# EAGLE design UNO lowcost V11 (EAGLE 6.2)
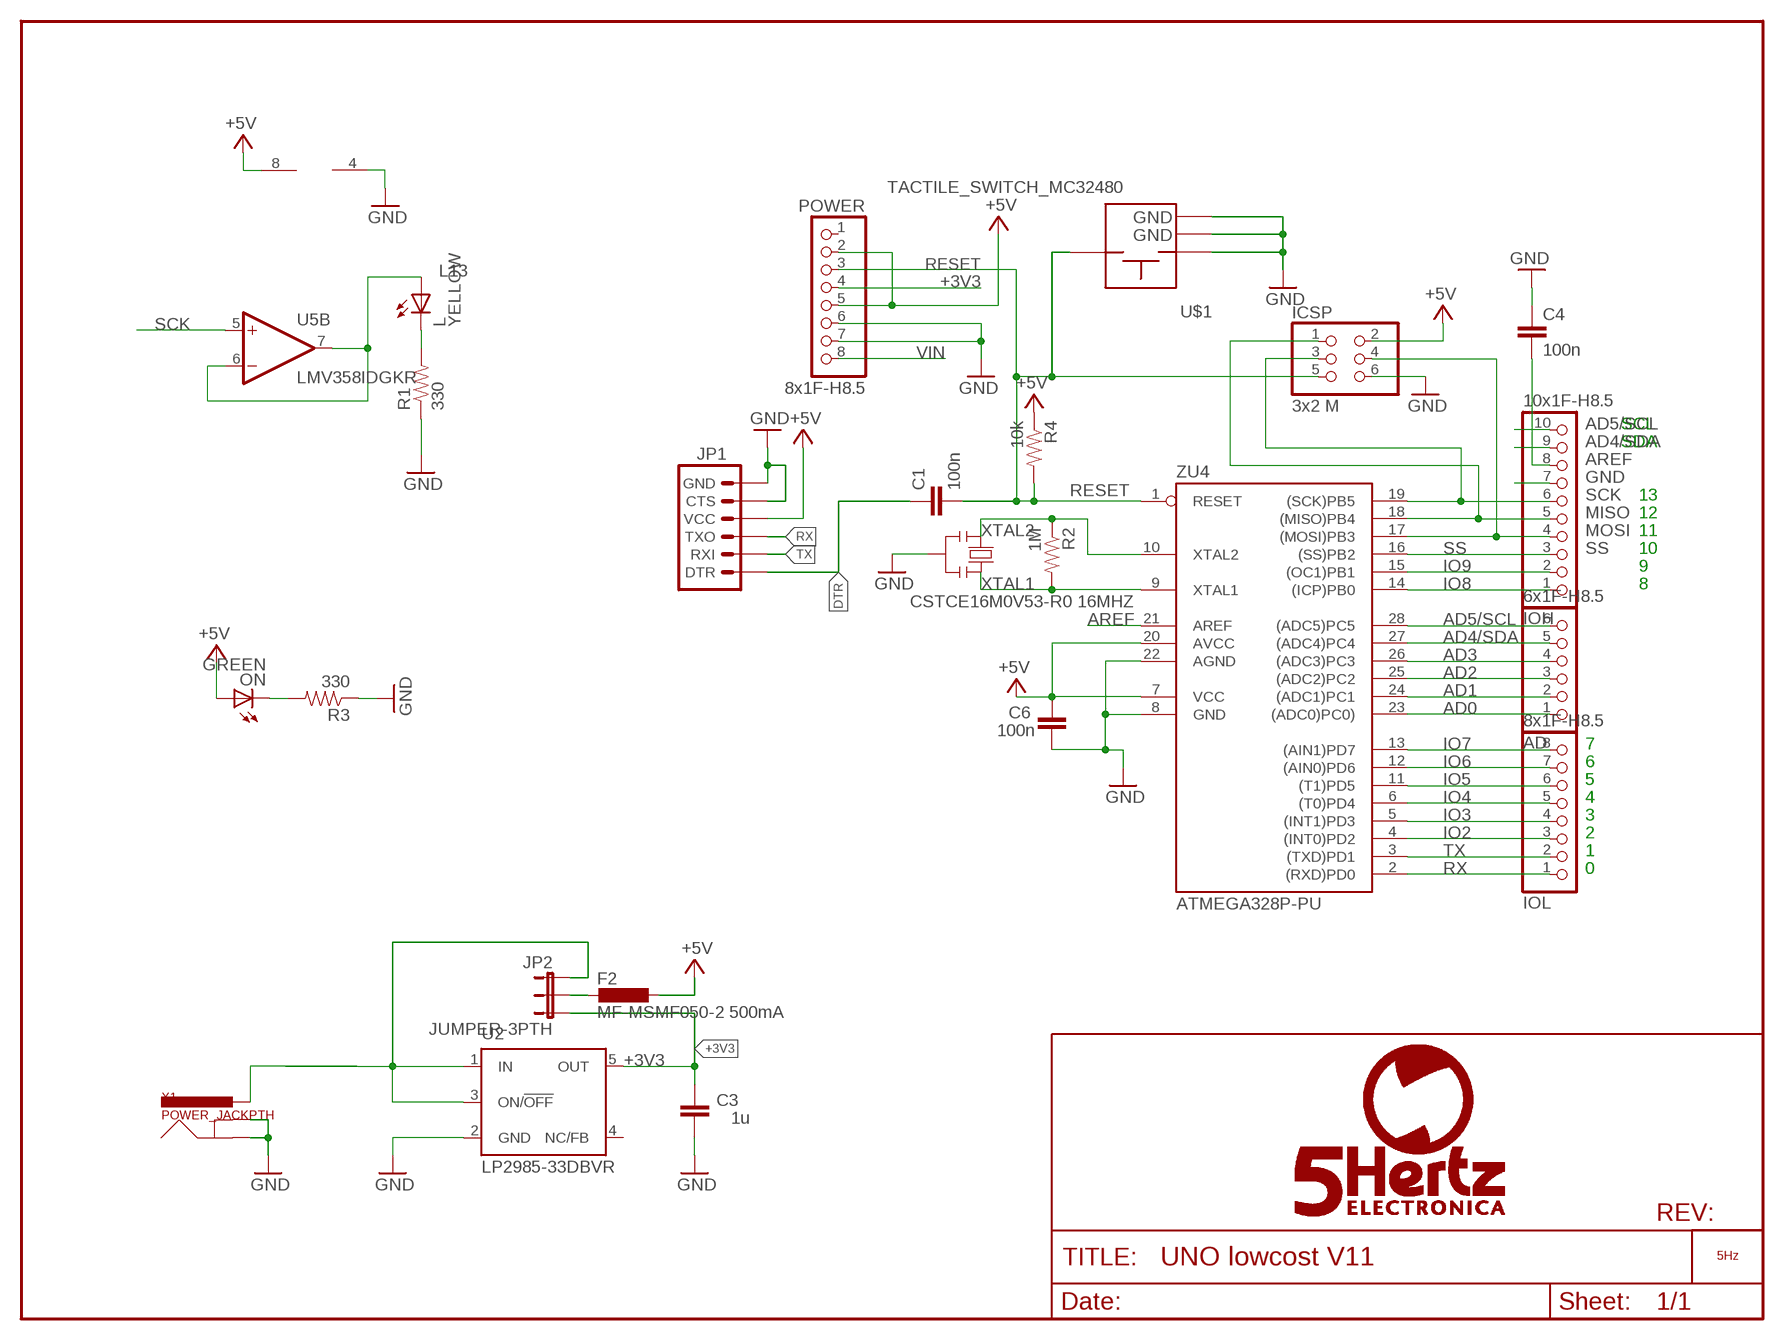
[diagram p0: schematic, sheet 1]

## Parts
AD  6x1F-H8.5  PINHD-1X6  [1X06]
C1  100n  C-EU0603-RND  [C0603-ROUND]
C3  1u  C-EU0603-RND  [C0603-ROUND]
C4  100n  C-EU0603-RND  [C0603-ROUND]
C6  100n  C-EU0603-RND  [C0603-ROUND]
F2  MF-MSMF050-2 500mA  L-EUL1812  [L1812]
ICSP  3x2 M  PINHD-2X3  [2X03]
IOH  10x1F-H8.5  PINHD-1X10_ARD  [1X10]
IOL  8x1F-H8.5  PINHD-1X8  [1X08]
JP1  ARDUINO_SERIAL_PROGRAMPTH  [1X06]
JP2  JUMPER-3PTH  [1X03]
L  YELLOW  LEDCHIP-LED0603  [CHIP-LED0603]
LOGO1  LOGO_5HZ_H_20MM  [5HZ_LOGO_H_20MM]
ON  GREEN  LEDCHIP-LED0603  [CHIP-LED0603]
POWER  8x1F-H8.5  PINHD-1X8  [1X08]
R1  330  RESISTOR0603-RES  [0603-RES]
R2  1M  RESISTOR0603-RES  [0603-RES]
R3  330  RESISTOR0603-RES  [0603-RES]
R4  10k  RESISTOR0603-RES  [0603-RES]
U2  LP2985-33DBVR  LP2985-XXDBVR33  [SOT23-DBV]
U5  LMV358IDGKR  LMV358MMX  [MSOP08]
U$1  TACTILE_SWITCH_MC32480  [MC32840]
X1  POWER_JACKPTH  [POWER_JACK_PTH]
Y2  CSTCE16M0V53-R0 16MHZ  RESONATORMU  [RESONATOR]
ZU4  ATMEGA328P-PU  [DIL28-3]

## Nets
5V/3V3 [usbvcc]: F2.2 JP2.2
+3V3: C3.2 JP2.3 POWER.4 U2.5(OUT)
+5V [usbvcc]: C6.2 F2.1 ICSP.2 JP1.4(VCC) ON.A POWER.2 POWER.5 R4.1 U5.8(P:V+) ZU4.7(VCC) ZU4.20(AVCC)
AD0: AD.1 ZU4.23((ADC0)PC0))
AD1: AD.2 ZU4.24((ADC1)PC1)
AD2: AD.3 ZU4.25((ADC2)PC2)
AD3: AD.4 ZU4.26((ADC3)PC3)
AD4/SDA: AD.5 IOH.9 ZU4.27((ADC4)PC4)
AD5/SCL: AD.6 IOH.10 ZU4.28((ADC5)PC5)
AREF [aref]: C4.2 IOH.8 ZU4.21(AREF)
DTR: C1.1 JP1.1(DTR)
GND [gnd]: C3.1 C4.1 C6.1 ICSP.6 IOH.7 JP1.5(CTS) JP1.6(GND) POWER.6 POWER.7 R1.1 R3.1 U2.2(GND) U5.4(P:V-) U$1.A@1(A) U$1.GND@1(GND) U$1.GND@2(GND) X1.GND X1.GNDBREAK Y2.2 ZU4.8(GND) ZU4.22(AGND)
IO2: IOL.3 ZU4.4((INT0)PD2)
IO3: IOL.4 ZU4.5((INT1)PD3)
IO4: IOL.5 ZU4.6((T0)PD4)
IO5: IOL.6 ZU4.11((T1)PD5)
IO6: IOL.7 ZU4.12((AIN0)PD6)
IO7: IOL.8 ZU4.13((AIN1)PD7)
IO8: IOH.1 ZU4.14((ICP)PB0)
IO9: IOH.2 ZU4.15((OC1)PB1)
L13: L.A U5.6(B:-IN) U5.7(B:OUT)
MISO: ICSP.1 IOH.5 ZU4.18((MISO)PB4)
MOSI: ICSP.4 IOH.4 ZU4.17((MOSI)PB3)
N$1: L.C R1.2
N$2: ON.C R3.2
RESET: C1.2 ICSP.5 POWER.3 R4.2 U$1.B ZU4.1(RESET)
RX: IOL.1 JP1.3(TXO) ZU4.2((RXD)PD0)
SCK: ICSP.3 IOH.6 U5.5(B:+IN) ZU4.19((SCK)PB5)
SS: IOH.3 ZU4.16((SS)PB2)
TX: IOL.2 JP1.2(RXI) ZU4.3((TXD)PD1)
VIN [power]: JP2.1 POWER.8 U2.1(IN) U2.3(ON/!OFF) X1.PWR
XTAL1: R2.2 Y2.3 ZU4.9(XTAL1)
XTAL2: R2.1 Y2.1 ZU4.10(XTAL2)
Unconnected: POWER.1 U2.4(NC/FB) U5.1(A:OUT) U5.2(A:-IN) U5.3(A:+IN)

## Notes on the sheet
- SCL
- SDA
- 13
- 12
- 11
- 10
- 9
- 8
- 7
- 6
- 5
- 4
- 3
- 2
- 1
- 0

## Library data of the parts
AD = SmartPrj:PINHD-1X6: PIN HEADER
C1 C3 C4 C6 = SmartPrj:C-EU: CAPACITOR, European symbol
F2 = rcl:L-EU: INDUCTOR, European symbol
ICSP = SmartPrj:PINHD-2X3: PIN HEADER
IOH = SmartPrj:PINHD-1X10_ARD: PIN HEADER
IOL POWER = SmartPrj:PINHD-1X8: PIN HEADER
JP1 = SparkFun_old:ARDUINO_SERIAL_PROGRAM
JP2 = SparkFun:JUMPER-3
L ON = adafruit:LED: LED OSRAM: - CHIPLED LG R971, LG N971, LY N971, LG Q971, LY Q971, LO R971, LY R971 LH N974, LH R974 LS Q976, LO Q976, LY Q976 LO Q996 - Hyper CHIPLED LW Q18S LB Q993, LB Q99A, LB R99A - SideLED LS A670, LO A670, LY A670, LG A670, LP A670 LB A673, LV A673, LT A673, LW A673 LH A674 LY A675 LS A676, LA A676, LO A676, LY A676, LW A676 LS A679, LY A679, LG A679 - Hyper Micro SIDELED® LS Y876, LA Y876, LO Y876, LY Y876 LT Y87S - SmartLED LW L88C, LW L88S LB L89C, LB L89S, LG L890 LS L89K, LO L89K, LY L89K LS L896, LA L896, LO L896, LY L896 - TOPLED LS T670, LO T670, LY T670, LG T670, LP T670 LSG T670, LSP T670, LSY T670, LOP T670, LYG T670 LG T671, LOG T671, LSG T671 LB T673, LV T673, LT T673, LW T673 LH T674 LS T676, LA T676, LO T676, LY T676, LB T676, LH T676, LSB T676, LW T676 LB T67C, LV T67C, LT T67C, LS T67K, LO T67K, LY T67K, LW E67C LS E67B, LA E67B, LO E67B, LY E67B, LB E67C, LV E67C, LT E67C LW T67C LS T679, LY T679, LG T679 LS T770, LO T770, LY T770, LG T770, LP T770 LB T773, LV T773, LT T773, LW T773 LH T774 LS E675, LA E675, LY E675, LS T675 LS T776, LA T776, LO T776, LY T776, LB T776 LHGB T686 LT T68C, LB T68C - Hyper Mini TOPLED® LB M676 - Mini TOPLED Santana® LG M470 LS M47K, LO M47K, LY M47K Source: http://www.osram.convergy.de/
LOGO1 = 5hz-electronica:LOGO_5HZ: Logotipo 5Hz "según Pedro"
R1-R4 = 5hz-electronica:RESISTOR: Resistor Basic schematic elements and footprints for 0603, 1206, and PTH 1/10th watt (small) resistors.
U2 = SmartPrj:LP2985-XXDBVR: ULTRALOW-POWER 50-mA LOW-DROPOUT LINEAR REGULATORS 50-mA Low-Dropout Regulator Source: http://focus.ti.com/lit/ds/symlink/tps77001.pdf
U5 = linear:LMV358?*: Dual General Purpose, Low Voltage, Rail-to-Rail Output Operational Amplifiers Source: http://www.national.com/mpf/LM/LMV321.html http://www.national.com/dt/lmv_qual.pdf
U$1 = PEDRO:TACTILE_SWITCH_MC32480
X1 = SparkFun:POWER_JACK: Power Jack This is the standard 5.5mm barrel jack for power. The PTH is the most common, proven, reliable, footprint. All others are experimental. The Slot footprint only works if the mill layer is transmitted to the PCB fab house so be warned. Spark Fun Electronics SKU : PRT-00119. Mating wall wart : TOL-00298 (and others)
Y2 = SmartPrj:RESONATOR
ZU4 = SmartPrj:ATMEGA328P-: MICROCONTROLLER 4 Kbytes FLASH 128 bytes SRAM 256 bytes EEPROM UART 6-channel 10 bit ADC

## Net classes
0 default: width 0.254 mm, clearance 0.254 mm
1 power: width 0.61 mm, drill 0.61 mm, clearance 0.254 mm
2 gnd: width 0.305 mm, drill 0.559 mm, clearance 0.254 mm
3 usbvcc: width 0.508 mm, drill 0.61 mm, clearance 0.254 mm
4 aref: width 0.406 mm, drill 0.61 mm, clearance 0.254 mm

## Board
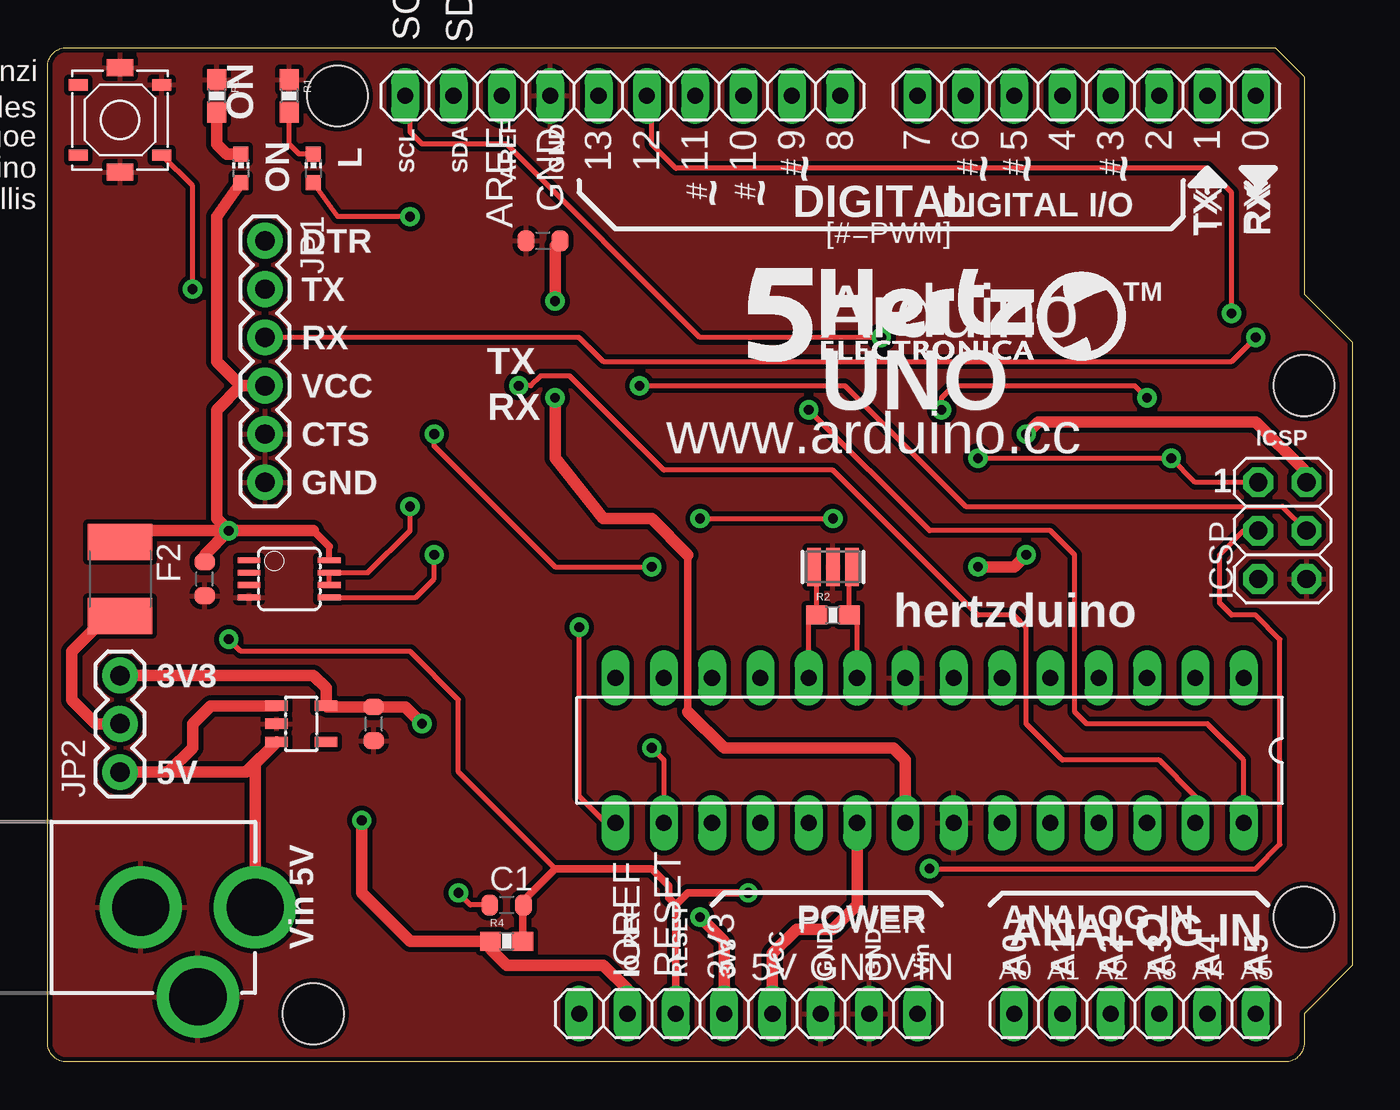
[diagram p1: board, top side]
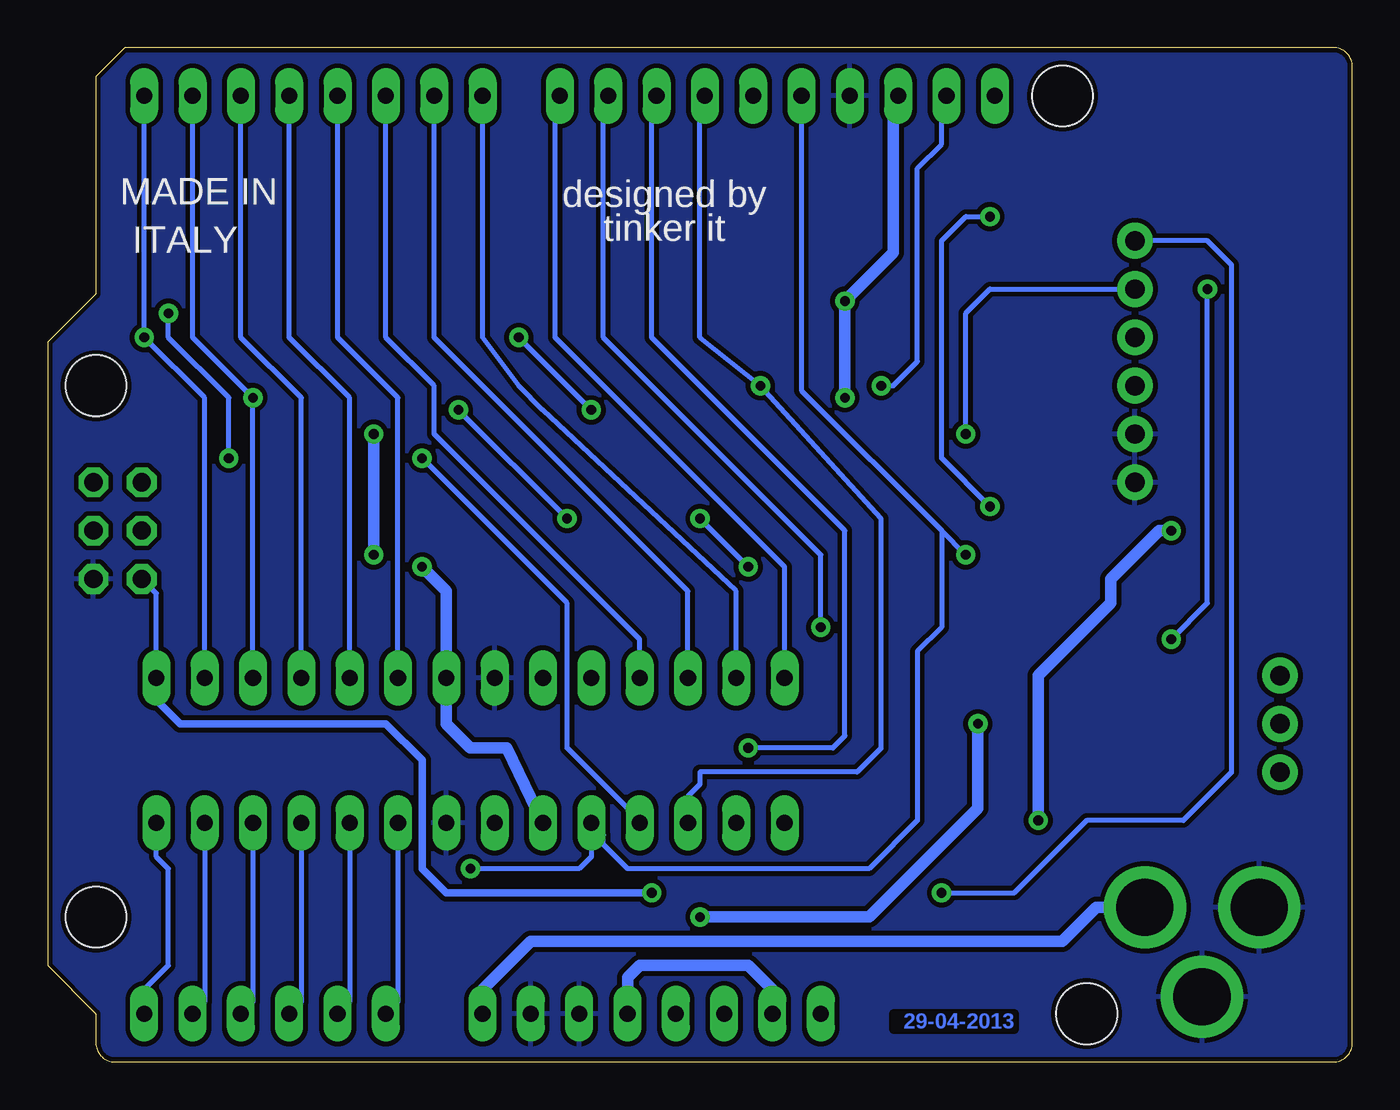
[diagram p2: board, bottom side, seen from below]

Size 68.58 x 53.34 mm. Coordinates in mm from the lower left corner, seen from the top.
Outline: 64.52,53.34 66.04,51.82 66.04,40.39 68.58,37.85 68.58,5.08 66.04,2.54 66.04,1 arc-90 65.04,0 1,0 arc-90 0,1 0,52.34 arc-90 1,53.34 64.52,53.34
Copper layers (1*16): Top 0.035mm / dielectric 1.5mm / Bottom 0.035mm
Design rules: minimum track width 8mil, minimum drill 20mil, track to track 8mil, track to pad 8mil, pad to pad 8mil, via to via 8mil, smd to smd 8mil, copper to edge 10mil, drill to drill 8mil, minimum pad ring 12mil, minimum via ring 10mil, stop-mask expansion 4mil, vias tented up to drill 25mil, thermal gap 10mil
Holes 3.2 mm at 66.04,35.56 66.04,7.62 15.24,50.8 13.97,2.54
vRestrict: area 22.9,44.1 to 24.6,49.1; area 25.4,45.5 to 27.1,49.1; area 28.4,45.3 to 29.6,48.8; area 31,45.3 to 32.1,48.8; area 33.5,45.3 to 34.7,48.8; area 36.1,45.3 to 37.2,48.8; area 38.7,47.2 to 39.9,48.8; area 40.3,45.1 to 47.6,46.9; area 60.3,44.2 to 61.7,46.7; area 62.9,44.2 to 64.3,46.7; area 61.3,35.8 to 64.8,37.2; area 0.6,21.8 to 2,30.1; 14 more areas

### Footprints (pad centres in the part's own frame; a part is rotated, then mirrored left to right if it is on the bottom)
1X06 = drill 0.85 pad 1.422 long: 1 -6.35,0; 2 -3.81,0; 3 -1.27,0; 4 1.27,0; 5 3.81,0; 6 6.35,0
C0603-ROUND = smd 0.898 x 1.1: 1 -0.889,0; 2 0.889,0
L1812 = smd 1.9 x 3.4: 1 -1.95,0; 2 1.95,0
2X03 = drill 0.95 pad 1.55 octagon: 1 -2.54,-1.27; 2 -2.54,1.27; 3 0,-1.27; 4 0,1.27; 5 2.54,-1.27; 6 2.54,1.27
1X10@1 = drill 0.85 pad 1.422 long: 1 -11.43,0; 2 -8.89,0; 3 -6.35,0; 4 -3.81,0; 5 -1.27,0; 6 1.27,0; 7 3.81,0; 8 6.35,0; 9 8.89,0; 10 11.43,0
1X08 = drill 0.85 pad 1.422 long: 1 -8.89,0; 2 -6.35,0; 3 -3.81,0; 4 -1.27,0; 5 1.27,0; 6 3.81,0; 7 6.35,0; 8 8.89,0
1X06' = drill 1.016 pad 1.88: 1 0,0; 2 2.54,0; 3 5.08,0; 4 7.62,0; 5 10.16,0; 6 12.7,0
1X03 = drill 1.016 pad 1.88: 1 0,0; 2 2.54,0; 3 5.08,0
CHIP-LED0603 = smd 0.8 x 0.8: A 0,-0.75; C 0,0.75
0603-RES = smd 1.1 x 1: 1 -0.85,0; 2 0.85,0
SOT23-DBV = smd 0.55 x 1.2: 1 -0.95,-1.3; 2 0,-1.3; 3 0.95,-1.3; 4 0.95,1.3; 5 -0.95,1.3
MSOP08 = smd 0.3 x 1.2: 1 -0.976,-2.113; 2 -0.326,-2.113; 3 0.324,-2.113; 4 0.974,-2.113; 5 0.974,2.112; 6 0.324,2.112; 7 -0.326,2.112; 8 -0.976,2.112
MC32840 = smd 0.6 x 1: A@1 -1.85,2.2; A@2 -1.85,-2.2; B 1.85,2.2; P$5 1.85,-2.2 | smd 0.9 x 1.4: GND@1 -2.75,0; GND@2 2.75,0
POWER_JACK_PTH = drill 2.997 pad 4.318: GND 0,7.7; GNDBREAK 4.7,10.7; PWR 0,13.7
RESONATOR = smd 0.7 x 2: 1 -1,0; 2 0,0; 3 1,0
DIL28-3 = drill 0.85 pad 1.422 long: 1 -16.51,-3.81; 2 -13.97,-3.81; 3 -11.43,-3.81; 4 -8.89,-3.81; 5 -6.35,-3.81; 6 -3.81,-3.81; 7 -1.27,-3.81; 8 1.27,-3.81; 9 3.81,-3.81; 10 6.35,-3.81; 11 8.89,-3.81; 12 11.43,-3.81; 13 13.97,-3.81; 14 16.51,-3.81; 15 16.51,3.81; 16 13.97,3.81; 17 11.43,3.81; 18 8.89,3.81; 19 6.35,3.81; 20 3.81,3.81; 21 1.27,3.81; 22 -1.27,3.81; 23 -3.81,3.81; 24 -6.35,3.81; 25 -8.89,3.81; 26 -11.43,3.81; 27 -13.97,3.81; 28 -16.51,3.81

### Placement (x,y rotation side)
AD  57.15,2.54 0 top
C1  24.13,8.26 0 top
C3  17.14,17.78 90 top
C4  26.04,43.18 0 top
C6  8.26,25.4 90 top
F2  3.81,25.4 270 top
ICSP  64.9,27.94 270 top
IOH  10x1F-H8.5  [1X10@1]  30.23,50.8 180 top
IOL  54.61,50.8 180 top
JP1  [1X06']  11.43,43.18 270 top
JP2  3.81,15.24 90 top
L  13.97,46.99 0 top
LOGO1  36.83,36.83 0 top
ON  10.16,46.99 0 top
POWER  36.83,2.54 0 top
R1  12.7,50.8 270 top
R2  41.27,23.5 0 top
R3  8.89,50.8 270 top
R4  24.13,6.35 0 top
U2  13.34,17.78 270 top
U5  12.7,25.4 270 top
U$1  3.81,49.53 270 top
X1  -2.79,8.13 270 top
Y2  41.27,26.04 0 top
ZU4  46.35,16.38 180 top

### Tracks (layer width: path | path; a pad name or v marks a point on that pad's centre or on a via)
5V/3V3
  Top 0.61: JP2.2 2.54,17.78 1.27,19.05 1.27,21.59 2.54,22.86 3.22,22.86 F2.2
+3V3  (via drill 0.51)
  Top 0.61: JP2.3 13.97,20.32 14.63,19.66 U2.5 14.7,18.67 C3.2 18.8,18.67 v19.68,17.78 | v34.29,7.62 35.56,6.35 POWER.4
  Bottom 0.61: v19.68,17.78 19.68,13.34 25.4,7.62 v34.29,7.62
+5V  (via drill 0.51)
  Top 0.305: U5.8 14.81,27.1
  Top 0.406: 14.81,27.1 13.97,27.94
  Top 0.61: ZU4.20 42.55,8.26 41.27,6.99 39.37,6.99 38.1,5.71 POWER.5 | v16.51,12.7 16.51,8.89 19.05,6.35 R4.1 23.28,5.93 24.13,5.08 29.21,5.08 30.48,3.81 POWER.2 | v48.9,26.04 50.8,26.04 v51.44,26.67 | v51.44,33.02 52.07,33.66 63.5,33.66 66.04,31.11 66.04,30.61 ICSP.2 | v9.53,27.94 4.4,27.94 F2.1 | C6.2 8.26,26.67 v9.53,27.94 | 13.97,27.94 v9.53,27.94 | JP1.4 10.16,35.56 | 10.16,35.56 8.89,34.29 8.89,28.57 v9.53,27.94 | 10.16,35.56 8.89,36.83 8.89,44.45 ON.A
  Bottom 0.61: POWER.5 38.1,4.45 37.47,5.08 31.75,5.08 30.48,3.81 POWER.2 | ZU4.20 44.45,16.51 46.35,16.51 47.62,17.78 ZU4.7 47.62,24.77 v48.9,26.04 | v51.44,26.67 v51.44,33.02 | v16.51,12.7 16.51,20.32 12.7,24.13 12.7,25.4 10.16,27.94 v9.53,27.94
AD0
  Bottom 0.254: ZU4.23 50.16,3.17 AD.1
AD1
  Bottom 0.254: ZU4.24 52.7,3.17 AD.2
AD2
  Bottom 0.254: ZU4.25 55.24,3.17 AD.3
AD3
  Bottom 0.254: ZU4.26 57.78,3.17 AD.4
AD4/SDA  (via drill 0.51)
  Top 0.254: ZU4.27 60.33,13.97 58.42,15.88 53.34,15.88 51.44,17.78 51.44,22.86 50.8,23.5 48.9,23.5 41.27,31.11 32.38,31.11 27.94,35.56 27.43,36.07 25.91,36.07 25.4,35.56 v24.77,35.56
  Bottom 0.254: ZU4.27 60.33,3.17 AD.5 | v24.77,35.56 24.13,35.56 22.86,36.83 22.86,46.99 21.59,48.26 21.59,50.55 IOH.9
AD5/SCL  (via drill 0.51)
  Top 0.254: ZU4.28 62.87,15.88 60.96,17.78 54.61,17.78 53.98,18.41 53.98,26.67 52.7,27.94 46.35,27.94 v40.01,34.29 | v43.81,38.1 34.29,38.1 24.13,48.26 19.68,48.26 19.05,48.9 19.05,50.55 IOH.10
  Bottom 0.254: AD.6 63.5,3.81 62.23,5.08 62.23,10.16 62.87,10.79 ZU4.28 | v40.01,34.29 v43.81,38.1
AREF  (via drill 0.51)
  Top 0.406: 33.66,18.41 33.66,26.67
  Top 0.61: ZU4.21 45.09,15.88 44.45,16.51 35.56,16.51 33.66,18.41 | 33.66,26.67 31.75,28.57 29.21,28.57 26.67,31.75 v26.67,34.92 | v26.67,40.01 26.67,42.93 C4.2
  Bottom 0.61: v26.67,34.92 v26.67,40.01 24.13,42.55 24.13,50.55 IOH.8
DTR  (via drill 0.51)
  Top 0.254: C1.1 22.23,8.26 v21.59,8.89
  Bottom 0.254: v21.59,8.89 17.78,8.89 13.97,12.7 8.89,12.7 6.35,15.24 6.35,41.91 7.62,43.18 JP1.1
GND
  pour Bottom: 0,0 0,53.34 64.77,53.34 66.04,52.07 66.04,40.64 68.58,38.1 68.58,5.08 66.04,2.54 66.04,0
  pour Top: 0,0 0,53.34 64.77,53.34 66.04,52.07 66.04,40.64 68.58,38.1 68.58,5.08 66.04,2.54 66.04,0
IO2
  Bottom 0.254: ZU4.4 55.24,34.92 58.42,38.1 IOL.3
IO3
  Bottom 0.254: ZU4.5 52.7,34.92 55.88,38.1 IOL.4
IO4
  Bottom 0.254: ZU4.6 50.16,34.92 53.34,38.1 IOL.5
IO5
  Bottom 0.254: ZU4.11 37.47,22.23 48.26,33.02 48.26,35.56 50.8,38.1 IOL.6
IO6
  Bottom 0.254: ZU4.12 34.92,24.77 48.26,38.1 IOL.7
IO7
  Bottom 0.254: ZU4.13 32.38,24.77 42.55,34.29 43.81,35.56 45.72,38.1 IOL.8
IO8
  Bottom 0.254: ZU4.14 29.84,26.04 41.91,38.1 41.91,50.8 IOH.1
IO9  (via drill 0.51)
  Top 0.254: ZU4.15 29.34,12.57 27.94,13.97 v27.94,22.86
  Bottom 0.254: IOH.2 39.37,50.55 39.37,38.1 27.94,26.67 v27.94,22.86
L13  (via drill 0.51)
  Top 0.254: U5.6 U5.7 16.84,25.73 19.05,27.94 v19.05,29.21 | v19.05,44.45 15.24,44.45 L.A
  Bottom 0.254: v19.05,29.21 21.59,31.75 21.59,43.18 20.32,44.45 v19.05,44.45
MISO  (via drill 0.51)
  Top 0.254: IOH.5 31.75,50.55 31.75,48.26 33.02,46.99 60.96,46.99 62.23,45.72 v62.23,39.37 | ICSP.1 60.33,30.48 v59.05,31.75 v48.9,31.75
  Bottom 0.254: ZU4.18 37.47,12.7 41.27,16.51 41.27,24.13 v48.9,31.75 | v59.05,31.75 59.05,34.92 62.23,38.1 v62.23,39.37
MOSI  (via drill 0.51)
  Top 0.254: v31.11,35.56 41.91,35.56 48.26,29.21 64.9,29.21 ICSP.4
  Bottom 0.254: IOH.4 34.29,50.55 34.29,38.1 v31.11,35.56 24.77,28.57 24.77,16.51 26.04,15.24 34.29,15.24 34.29,14.61 34.92,13.97 ZU4.17
N$1
  Top 0.254: L.C 13.22,47.74 12.7,48.26 R1.2
N$2
  Top 0.61: ON.C 9.41,47.74 8.89,48.26 R3.2
RESET  (via drill 0.51)
  Top 0.254: 26.67,10.16 21.59,15.24 21.59,19.05 19.05,21.59 10.16,21.59 v9.53,22.23 | 6.35,47.34 U$1.B 7.62,46.07 v7.62,40.64
  Top 0.406: v36.83,8.89 33.66,8.89 33.02,8.26 | POWER.3 33.02,8.26 | 33.02,8.26 32.64,8.64 32.64,9.27 31.75,10.16 26.67,10.16 25.02,8.51 C1.2 24.98,8.22 R4.2
  Bottom 0.254: ZU4.1 62.87,24.64 ICSP.5 | v9.53,22.23 7.62,24.13 v7.62,40.64
  Bottom 0.406: v36.83,8.89 47.62,8.89 48.9,10.16 48.9,15.88 50.8,17.78 61.59,17.78 62.87,19.05 ZU4.1
RX  (via drill 0.51)
  Top 0.254: v63.5,38.1 62.23,36.83 29.21,36.83 27.94,38.1 JP1.3
  Bottom 0.254: ZU4.2 60.33,34.92 v63.5,38.1 IOL.1
SCK  (via drill 0.51)
  Top 0.254: U5.5 19.35,24.43 20.32,25.4 v20.32,26.67 | v46.35,10.16 63.5,10.16 64.77,11.43 64.77,22.23 63.5,23.5 62.23,23.5 61.59,24.13 61.59,26.67 62.87,27.94 ICSP.3
  Bottom 0.254: IOH.6 28.96,35.31 21.59,27.94 | 21.59,27.94 21.59,22.86 22.86,21.59 22.86,12.7 25.4,10.16 38.1,10.16 39.37,11.43 39.37,11.94 ZU4.19 40.01,10.79 40.64,10.16 v46.35,10.16 | v20.32,26.67 21.59,27.94
SS  (via drill 0.51)
  Top 0.254: v31.75,16.51 32.38,15.88 ZU4.16
  Bottom 0.254: IOH.3 36.83,50.55 36.83,38.1 26.67,27.94 26.67,17.14 27.3,16.51 v31.75,16.51
TX  (via drill 0.51)
  Top 0.254: v57.78,34.92 57.15,35.56 47.62,35.56 46.99,34.92 v46.99,34.29 | v31.75,26.04 26.67,26.04 20.32,32.38 v20.32,33.02 | v34.29,28.57 v41.27,28.57
  Bottom 0.254: ZU4.3 v57.78,34.92 60.96,38.1 IOL.2 | v31.75,26.04 v34.29,28.57 | v41.27,28.57 v46.99,34.29 | v20.32,33.02 20.32,39.37 19.05,40.64 JP1.2
VIN
  Top 0.61: JP2.1 6.35,15.24 | 6.35,15.24 10.45,15.24 U2.3 10.91,15.7 X1.PWR | U2.1 8.57,18.73 7.62,17.78 7.62,16.51 6.35,15.24
  Bottom 0.61: X1.PWR 13.46,8.13 15.24,6.35 43.18,6.35 45.72,3.81 POWER.8
XTAL1
  Top 0.254: ZU4.9 42.55,23.07 R2.2 42.12,25.89 Y2.3
XTAL2
  Top 0.254: ZU4.10 40.01,23.07 R2.1 40.42,25.89 Y2.1

### Text on the board
Bottom: 29-04-2013
tPlace: 13 | 12 | 11 | 10 | 9 | 8 | 7 | 6 | 5 | 4 | 3 | 2 | 1 | 0 | L | SCL | SDA | GND | ON | AREF | ~ | ~ | ~ | ~ | ~ | ~ | DIGITAL I/O | DTR | TX | RX | TX | RX | VCC | CTS | ICSP | GND | hertzduino | 3V3 | 5V | Vin 5V | POWER | ANALOG IN | IO REF | RESET | 3V3 | VCC | GND | GND | Vin | A0 | A1 | A2 | A3 | A4 | A5
tNames: SCL | SDA | M.Banzi | D.Cuartielles | T.Igoe | AREF | GND | G.Martino | # | # | # | # | D.Mellis | # | # | DIGITAL | [#=PWM] | TX | RX | TM | TX | Arduino | RX | UNO | www.arduino.cc | 1 | ANALOG IN | IOREF | RESET | 3V3 | 5V | GND | VIN | A0 | A1 | A2 | A3 | A4 | A5
bNames: MADE IN | designed by | MADE IN | ITALY | tinker it | ITALY | designed by | tinker it | ATMEGA328
ReferenceLC: L | TX | ON | RX | PC1 | PC2
214bmp: D:/SmartProjects/Snc/a4_bn_logo2.bmp